# Altium project prototype_dual_channel.PrjPcb
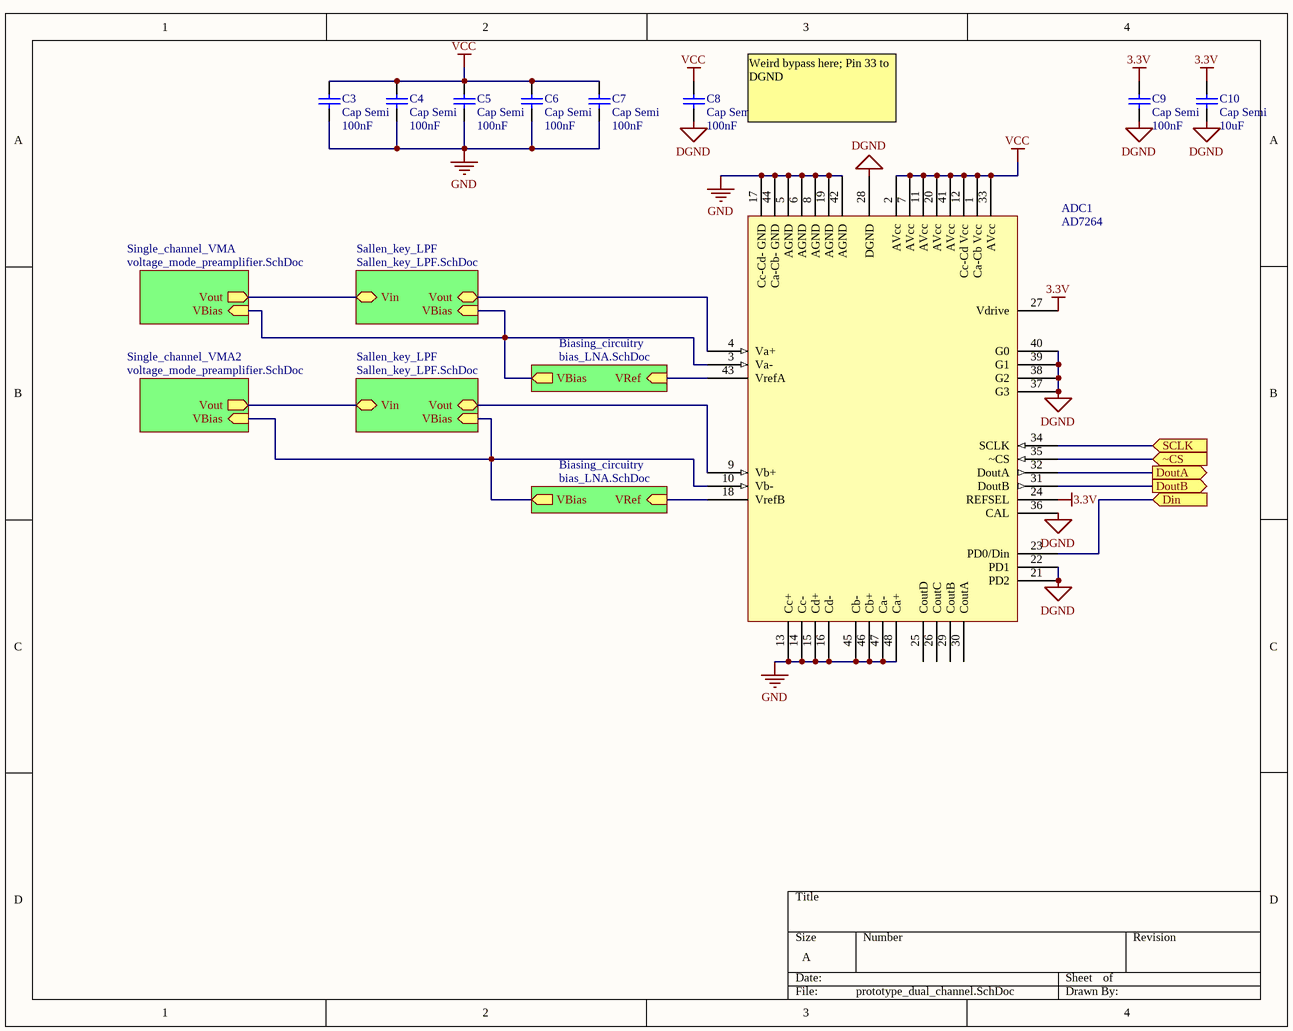
[diagram p0: prototype_dual_channel.SchDoc]
5 sheets, 53 parts. Net scope: hierarchical (ports join the sheet entries above them; power ports are global).
Sheets:
  prototype_dual_channel.SchDoc
    Single_channel_VMA = voltage_mode_preamplifier.SchDoc
    Single_channel_VMA2 = voltage_mode_preamplifier.SchDoc
    Sallen_key_LPF = Sallen_key_LPF.SchDoc
    Biasing_circuitry = bias_LNA.SchDoc
    Sallen_key_LPF = Sallen_key_LPF.SchDoc
    Biasing_circuitry = bias_LNA.SchDoc
  main_stack_dual_channel.SchDoc

## Sheet prototype_dual_channel.SchDoc
size A

### Parts
ADC1  AD7264  [TSQFP50P900X900-48N]
C3  Cap Semi  value 100nF  [C0805]
C4  Cap Semi  value 100nF  [C0805]
C5  Cap Semi  value 100nF  [C0805]
C6  Cap Semi  value 100nF  [C0805]
C7  Cap Semi  value 100nF  [C0805]
C8  Cap Semi  value 100nF  [C0805]
C9  Cap Semi  value 100nF  [C0805]
C10  Cap Semi  value 10uF  [C0805]

### Sub-sheets
Biasing_circuitry = bias_LNA.SchDoc: VRef (in), VBias (out)
Biasing_circuitry = bias_LNA.SchDoc: VRef (in), VBias (out)
Sallen_key_LPF = Sallen_key_LPF.SchDoc: VBias (in), Vin, Vout
Sallen_key_LPF = Sallen_key_LPF.SchDoc: VBias (in), Vin, Vout
Single_channel_VMA = voltage_mode_preamplifier.SchDoc: Vout (out), VBias (in)
Single_channel_VMA2 = voltage_mode_preamplifier.SchDoc: Vout (out), VBias (in)

### Ports
Din (in), DoutA (out), DoutB (out), SCLK (in), ~CS (in)

### Nets
3.3V: ADC1.24(REFSEL) ADC1.27(Vdrive) C9.2 C10.2
DGND: ADC1.21(PD2) ADC1.22(PD1) ADC1.28(DGND) ADC1.36(CAL) ADC1.37(G3) ADC1.38(G2) ADC1.39(G1) ADC1.40(G0) C8.1 C9.1 C10.1
GND: ADC1.5(AGND) ADC1.6(AGND) ADC1.8(AGND) ADC1.13(Cc+) ADC1.14(Cc-) ADC1.15(Cd+) ADC1.16(Cd-) ADC1.17(Cc-Cd-_GND) ADC1.19(AGND) ADC1.42(AGND) ADC1.44(Ca-Cb-_GND) ADC1.45(Cb-) ADC1.46(Cb+) ADC1.47(Ca-) ADC1.48(Ca+) C3.1 C4.1 C5.1 C6.1 C7.1
VCC: ADC1.1(Ca-Cb_Vcc) ADC1.2(AVcc) ADC1.7(AVcc) ADC1.11(AVcc) ADC1.12(Cc-Cd_Vcc) ADC1.20(AVcc) ADC1.33(AVcc) ADC1.41(AVcc) C3.2 C4.2 C5.2 C6.2 C7.2 C8.2
NetADC1_3: ADC1.3(Va-) ; sheet Single_channel_VMA/VBias, sheet Sallen_key_LPF/VBias, sheet Biasing_circuitry/VBias
NetADC1_4: ADC1.4(Va+) ; sheet Sallen_key_LPF/Vout
NetADC1_9: ADC1.9(Vb+) ; sheet Sallen_key_LPF/Vout
NetADC1_10: ADC1.10(Vb-) ; sheet Single_channel_VMA2/VBias, sheet Sallen_key_LPF/VBias, sheet Biasing_circuitry/VBias
NetADC1_18: ADC1.18(VrefB) ; sheet Biasing_circuitry/VRef
NetADC1_23: ADC1.23(PD0/Din) ; port Din
NetADC1_31: ADC1.31(DoutB) ; port DoutB
NetADC1_32: ADC1.32(DoutA) ; port DoutA
NetADC1_34: ADC1.34(SCLK) ; port SCLK
NetADC1_35: ADC1.35(~CS) ; port ~CS
NetADC1_43: ADC1.43(VrefA) ; sheet Biasing_circuitry/VRef
NetR1_Single_channel_VMA2_2: sheet Single_channel_VMA2/Vout, sheet Sallen_key_LPF/Vin
NetR1_Single_channel_VMA_2: sheet Single_channel_VMA/Vout, sheet Sallen_key_LPF/Vin

Not connected (* = marked no-connect by the designer): ADC1 25(CoutD) 26(CoutC) 29(CoutB) 30(CoutA)

### Notes on the sheet
- Weird bypass here; Pin 33 to DGND

### Library data of the parts
ADC1 = AD7264: AD7264 - 14 bit 1MSPS 2 channel ADC
C3-C10 = Cap Semi: Capacitor (Semiconductor SIM Model); Published: 8-Jun-2000; LatestRevisionDate: 29-May-2009; LatestRevisionNote: IPC-7351 Footprint Added.; PackageReference: C1206; Publisher: Altium Limited; PackageDescription: Chip Capacitor

## Sheet voltage_mode_preamplifier.SchDoc
size A
Used 2 times, as channels Single_channel_VMA, Single_channel_VMA2. Parts and nets are listed once, with the designators drawn on the sheet.
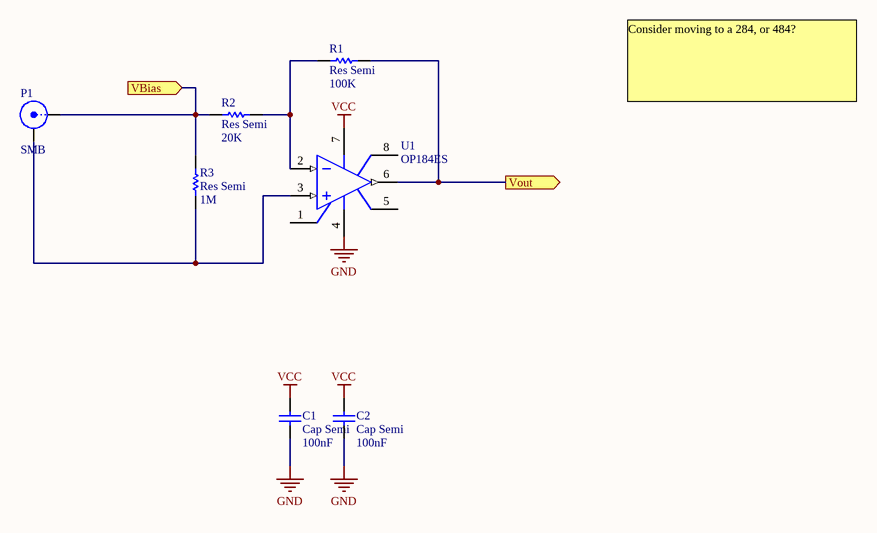
[diagram p1: voltage_mode_preamplifier.SchDoc]

### Parts
C1  Cap Semi  value 100nF  [C0805]
C2  Cap Semi  value 100nF  [C0805]
P1  SMB  [SMB_V-RJ45]
R1  Res Semi  value 100K  [RESC2012L]
R2  Res Semi  value 20K  [RESC2012L]
R3  Res Semi  value 1M  [RESC2012L]
U1  OP184ES  [SO-8_N]

### Ports
VBias (in), Vout (out)

### Nets
GND: C1.1 C2.1 U1.4(V-)
VCC: C1.2 C2.2 U1.7(V+)
VBias: P1.1(X) R2.1 R3.2 ; port VBias
Vout: R1.2 U1.6(OUT) ; port Vout
NetP1_2: P1.2(Y) R3.1 U1.3(IN+)
NetR1_1: R1.1 R2.2 U1.2(IN-)

Not connected (* = marked no-connect by the designer): U1 1(NUL) 5(NUL) 8(NC)

### Channels
Single_channel_VMA: designators end in _Single_channel_VMA; ports VBias=NetADC1_3 Vout=NetR1_Single_channel_VMA_2
Single_channel_VMA2: designators end in _Single_channel_VMA2; ports VBias=NetADC1_10 Vout=NetR1_Single_channel_VMA2_2

### Notes on the sheet
- Consider moving to a 284, or 484?

### Library data of the parts
C1 C2 = Cap Semi: Capacitor (Semiconductor SIM Model); Published: 8-Jun-2000; LatestRevisionDate: 29-May-2009; LatestRevisionNote: IPC-7351 Footprint Added.; PackageReference: C1206; Publisher: Altium Limited; PackageDescription: Chip Capacitor
P1 = SMB: SMB Straight Connector; LatestRevisionDate: 17-Jul-2002; LatestRevisionNote: Re-released for DXP Platform.; Publisher: Altium Limited
R1-R3 = Res Semi: Semiconductor Resistor; Published: 8-Jun-2000; LatestRevisionDate: 17-Jul-2002; LatestRevisionNote: Re-released for DXP Platform.; PackageReference: AXIAL-0.5; Publisher: Altium Limited
U1 = OP184ES: Precision Rail-to-Rail Input and Ouput Operational Amplifier; Note: Pin 8 is not connected.; Published: 8-Jun-2000; LatestRevisionDate: 13-Apr-2006; LatestRevisionNote: IPC-7351 Footprint Added.; DatasheetVersion: REV. 0 1996; PackageVersion: revA; PackageReference: SO-8; Publisher: Altium Limited; PackageDescription: 8-Pin Small Outline Integrated Circuit 1.27 mm Pitch; Code_JEDEC: MS-012-AA; Code_IPC: SOIC127P600-8; ComponentLink1Description: Manufacturer Link; ComponentLink1URL: http://www.analog.com/en/prod/0,,759_786_OP184%2C00.html; ComponentLink2Description: Datasheet; ComponentLink2URL: http://www.analog.com/UploadedFiles/Data_Sheets/390492658OP184_284_484_b.pdf; Digikey PN: OP184FSZ-REEL7CT-ND

## Sheet Sallen_key_LPF.SchDoc
size A
Used 2 times, as channels Sallen_key_LPF, Sallen_key_LPF. Parts and nets are listed once, with the designators drawn on the sheet.
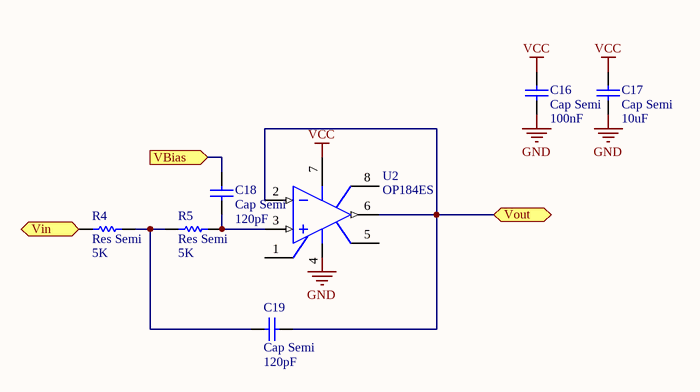
[diagram p2: Sallen_key_LPF.SchDoc]

### Parts
C16  Cap Semi  value 100nF  [C0805]
C17  Cap Semi  value 10uF  [C0805]
C18  Cap Semi  value 120pF  [C0805]
C19  Cap Semi  value 120pF  [C0805]
R4  Res Semi  value 5K  [RESC2012L]
R5  Res Semi  value 5K  [RESC2012L]
U2  OP184ES  [SO-8_N]

### Ports
VBias (in), Vin, Vout

### Nets
GND: C16.1 C17.1
VCC: C16.2 C17.2 U2.7(V+)
VBias: C18.2 ; port VBias
Vin: R4.1 ; port Vin
Vout: C19.1 U2.2(IN-) U2.6(OUT) ; port Vout
NetC18_1: C18.1 R5.2 U2.3(IN+)
NetC19_2: C19.2 R4.2 R5.1

Not connected (* = marked no-connect by the designer): U2 1(NUL) 4(V-) 5(NUL) 8(NC)

### Channels
Sallen_key_LPF: designators end in _Sallen_key_LPF#1; ports VBias=NetADC1_3 Vin=NetR1_Single_channel_VMA_2 Vout=NetADC1_4
Sallen_key_LPF: designators end in _Sallen_key_LPF#2; ports VBias=NetADC1_10 Vin=NetR1_Single_channel_VMA2_2 Vout=NetADC1_9

### Notes on the sheet
- Labels drawn without touching a wire or pin: GND

### Library data of the parts
C16-C19 = Cap Semi: Capacitor (Semiconductor SIM Model); Published: 8-Jun-2000; LatestRevisionDate: 29-May-2009; LatestRevisionNote: IPC-7351 Footprint Added.; PackageReference: C1206; Publisher: Altium Limited; PackageDescription: Chip Capacitor
R4 R5 = Res Semi: Semiconductor Resistor; Published: 8-Jun-2000; LatestRevisionDate: 17-Jul-2002; LatestRevisionNote: Re-released for DXP Platform.; PackageReference: AXIAL-0.5; Publisher: Altium Limited
U2 = OP184ES: as U1 on sheet voltage_mode_preamplifier; Published: 8-Jun-2000; LatestRevisionDate: 13-Apr-2006; LatestRevisionNote: IPC-7351 Footprint Added.; DatasheetVersion: REV. 0 1996; PackageVersion: revA; PackageReference: SO-8; Publisher: Altium Limited; PackageDescription: 8-Pin Small Outline Integrated Circuit 1.27 mm Pitch; Code_JEDEC: MS-012-AA; Code_IPC: SOIC127P600-8; ComponentLink1Description: Manufacturer Link; ComponentLink1URL: http://www.analog.com/en/prod/0,,759_786_OP184%2C00.html; ComponentLink2Description: Datasheet; ComponentLink2URL: http://www.analog.com/UploadedFiles/Data_Sheets/390492658OP184_284_484_b.pdf

## Sheet bias_LNA.SchDoc
size A
Used 2 times, as channels Biasing_circuitry, Biasing_circuitry. Parts and nets are listed once, with the designators drawn on the sheet.
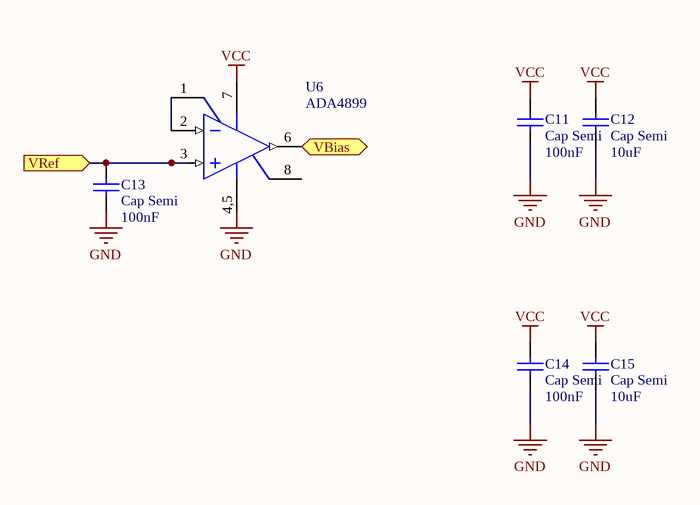
[diagram p3: bias_LNA.SchDoc]

### Parts
C11  Cap Semi  value 100nF  [C0805]
C12  Cap Semi  value 10uF  [C0805]
C13  Cap Semi  value 100nF  [C0805]
C14  Cap Semi  value 100nF  [C0805]
C15  Cap Semi  value 10uF  [C0805]
U6  ADA4899  [SO8_N]

### Ports
VBias (out), VRef (in)

### Nets
GND: C11.1 C12.1 C13.1 C14.1 C15.1 U6.4,5(V-)
VCC: C11.2 C12.2 C14.2 C15.2 U6.7(V+)
VBias: U6.6(OUT) ; port VBias
VRef: C13.2 U6.3(IN+) ; port VRef
NetU6_1: U6.1(FB) U6.2(IN-)

Not connected (* = marked no-connect by the designer): U6 8(CMPEN)

### Channels
Biasing_circuitry: designators end in _Biasing_circuitry#1; ports VBias=NetADC1_3 VRef=NetADC1_43
Biasing_circuitry: designators end in _Biasing_circuitry#2; ports VBias=NetADC1_10 VRef=NetADC1_18

### Library data of the parts
C11-C15 = Cap Semi: Capacitor (Semiconductor SIM Model); Published: 8-Jun-2000; LatestRevisionDate: 29-May-2009; LatestRevisionNote: IPC-7351 Footprint Added.; PackageReference: C1206; Publisher: Altium Limited; PackageDescription: Chip Capacitor
U6 = ADA4899: High Speed, Low Voltage Noise, Unity Gain Stable Op-Amp

## Sheet main_stack_dual_channel.SchDoc
size A
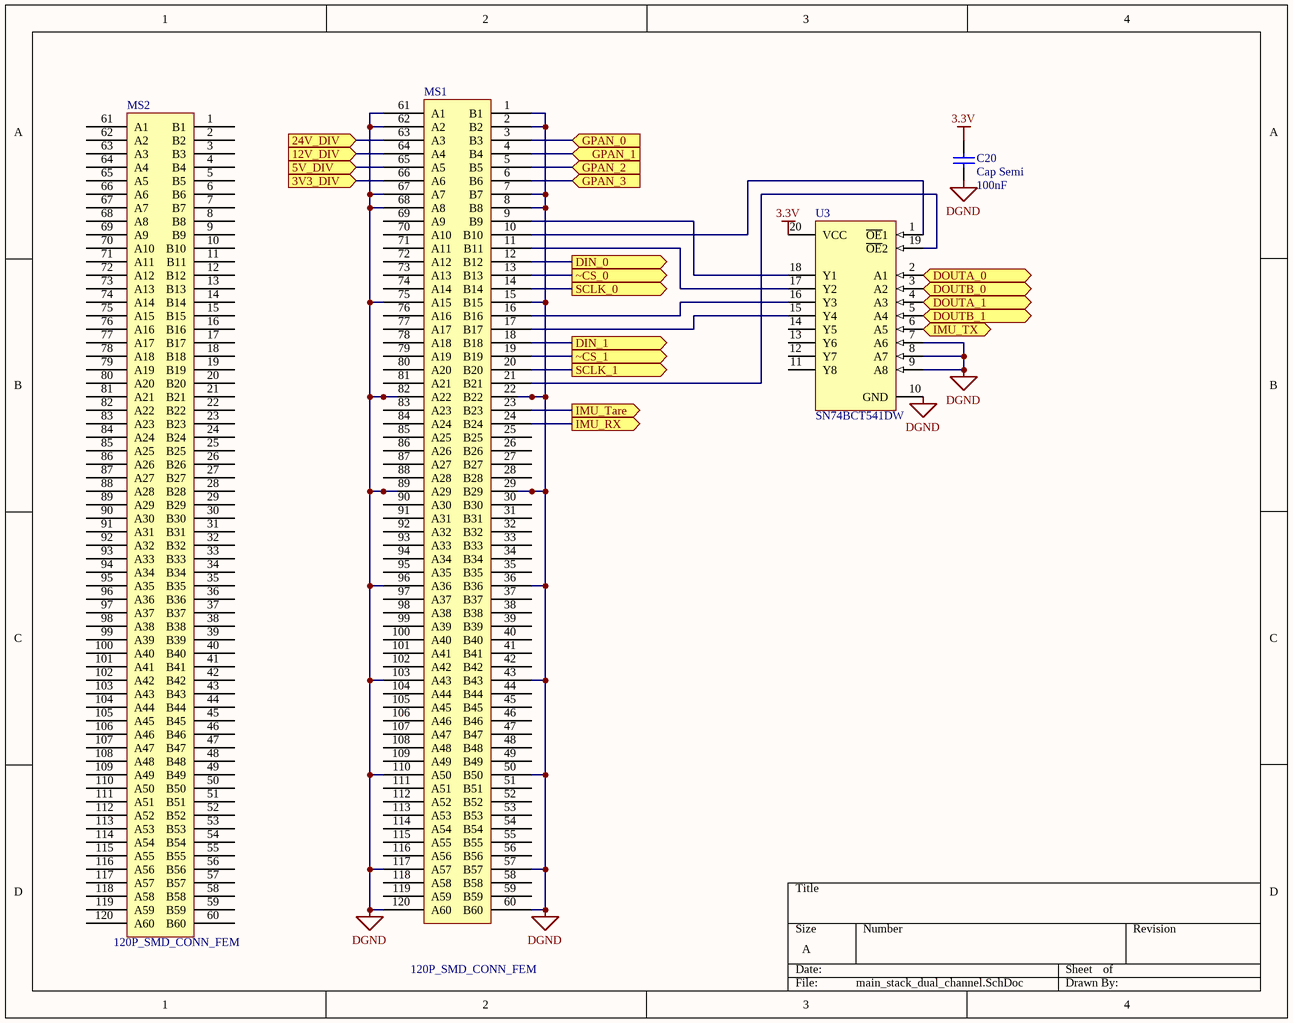
[diagram p4: main_stack_dual_channel.SchDoc]

### Parts
C20  Cap Semi  value 100nF  [C0805]
MS1  120P_SMD_CONN_FEM
MS2  120P_SMD_CONN_FEM
U3  SN74BCT541DW  [DW020_N]

### Ports
3V3_DIV (in), 5V_DIV (in), 12V_DIV (in), 24V_DIV (in), DIN_0 (out), DIN_1 (out), DOUTA_0 (in), DOUTA_1 (in), DOUTB_0 (in), DOUTB_1 (in), GPAN_0 (in), GPAN_1 (in), GPAN_2 (in), GPAN_3 (in), IMU_RX (out), IMU_Tare (out), IMU_TX (in), SCLK_0 (out), SCLK_1 (out), ~CS_0 (out), ~CS_1 (out)

### Nets
3.3V: C20.2 U3.20(VCC)
DGND: C20.1 MS1.1(B1) MS1.2(B2) MS1.7(B7) MS1.8(B8) MS1.15(B15) MS1.22(B22) MS1.29(B29) MS1.36(B36) MS1.43(B43) MS1.50(B50) MS1.57(B57) MS1.60(B60) MS1.61(A1) MS1.62(A2) MS1.67(A7) MS1.68(A8) MS1.75(A15) MS1.82(A22) MS1.89(A29) MS1.96(A36) MS1.103(A43) MS1.110(A50) MS1.117(A57) MS1.120(A60) U3.7(A6) U3.8(A7) U3.9(A8) U3.10(GND)
NetMS1_3: MS1.3(B3) ; port GPAN_0
NetMS1_4: MS1.4(B4) ; port GPAN_1
NetMS1_5: MS1.5(B5) ; port GPAN_2
NetMS1_6: MS1.6(B6) ; port GPAN_3
NetMS1_9: MS1.9(B9) U3.18(Y1)
NetMS1_10: MS1.10(B10) U3.1(~{OE}1)
NetMS1_11: MS1.11(B11) U3.17(Y2)
NetMS1_12: MS1.12(B12) ; port DIN_0
NetMS1_13: MS1.13(B13) ; port ~CS_0
NetMS1_14: MS1.14(B14) ; port SCLK_0
NetMS1_16: MS1.16(B16) U3.16(Y3)
NetMS1_17: MS1.17(B17) U3.15(Y4)
NetMS1_18: MS1.18(B18) ; port DIN_1
NetMS1_19: MS1.19(B19) ; port ~CS_1
NetMS1_20: MS1.20(B20) ; port SCLK_1
NetMS1_21: MS1.21(B21) U3.19(~{OE}2)
NetMS1_23: MS1.23(B23) ; port IMU_Tare
NetMS1_24: MS1.24(B24) ; port IMU_RX
NetMS1_63: MS1.63(A3) ; port 24V_DIV
NetMS1_64: MS1.64(A4) ; port 12V_DIV
NetMS1_65: MS1.65(A5) ; port 5V_DIV
NetMS1_66: MS1.66(A6) ; port 3V3_DIV
NetU3_2: U3.2(A1) ; port DOUTA_0
NetU3_3: U3.3(A2) ; port DOUTB_0
NetU3_4: U3.4(A3) ; port DOUTA_1
NetU3_5: U3.5(A4) ; port DOUTB_1
NetU3_6: U3.6(A5) ; port IMU_TX

Not connected (* = marked no-connect by the designer): MS1 25(B25) 26(B26) 27(B27) 28(B28) 30(B30) 31(B31) 32(B32) 33(B33) 34(B34) 35(B35) 37(B37) 38(B38) 39(B39) 40(B40) 41(B41) 42(B42) 44(B44) 45(B45) 46(B46) 47(B47) 48(B48) 49(B49) 51(B51) 52(B52) 53(B53) 54(B54) 55(B55) 56(B56) 58(B58) 59(B59) 69(A9) 70(A10) 71(A11) 72(A12) 73(A13) 74(A14) 76(A16) 77(A17) 78(A18) 79(A19) 80(A20) 81(A21) 83(A23) 84(A24) 85(A25) 86(A26) 87(A27) 88(A28) 90(A30) 91(A31) 92(A32) 93(A33) 94(A34) 95(A35) 97(A37) 98(A38) 99(A39) 100(A40) 101(A41) 102(A42) 104(A44) 105(A45) 106(A46) 107(A47) 108(A48) 109(A49) 111(A51) 112(A52) 113(A53) 114(A54) 115(A55) 116(A56) 118(A58) 119(A59); MS2 1(B1) 2(B2) 3(B3) 4(B4) 5(B5) 6(B6) 7(B7) 8(B8) 9(B9) 10(B10) 11(B11) 12(B12) 13(B13) 14(B14) 15(B15) 16(B16) 17(B17) 18(B18) 19(B19) 20(B20) 21(B21) 22(B22) 23(B23) 24(B24) 25(B25) 26(B26) 27(B27) 28(B28) 29(B29) 30(B30) 31(B31) 32(B32) 33(B33) 34(B34) 35(B35) 36(B36) 37(B37) 38(B38) 39(B39) 40(B40) 41(B41) 42(B42) 43(B43) 44(B44) 45(B45) 46(B46) 47(B47) 48(B48) 49(B49) 50(B50) 51(B51) 52(B52) 53(B53) 54(B54) 55(B55) 56(B56) 57(B57) 58(B58) 59(B59) 60(B60) 61(A1) 62(A2) 63(A3) 64(A4) 65(A5) 66(A6) 67(A7) 68(A8) 69(A9) 70(A10) 71(A11) 72(A12) 73(A13) 74(A14) 75(A15) 76(A16) 77(A17) 78(A18) 79(A19) 80(A20) 81(A21) 82(A22) 83(A23) 84(A24) 85(A25) 86(A26) 87(A27) 88(A28) 89(A29) 90(A30) 91(A31) 92(A32) 93(A33) 94(A34) 95(A35) 96(A36) 97(A37) 98(A38) 99(A39) 100(A40) 101(A41) 102(A42) 103(A43) 104(A44) 105(A45) 106(A46) 107(A47) 108(A48) 109(A49) 110(A50) 111(A51) 112(A52) 113(A53) 114(A54) 115(A55) 116(A56) 117(A57) 118(A58) 119(A59) 120(A60); U3 11(Y8) 12(Y7) 13(Y6) 14(Y5)

### Library data of the parts
C20 = Cap Semi: Capacitor (Semiconductor SIM Model); Published: 8-Jun-2000; LatestRevisionDate: 29-May-2009; LatestRevisionNote: IPC-7351 Footprint Added.; PackageReference: C1206; Publisher: Altium Limited; PackageDescription: Chip Capacitor
MS1 MS2 = 120P_SMD_CONN_FEM: Main Stack Connector, Female; Part Number: FX2-120P-1.27SV(71)
U3 = SN74BCT541DW: Octal Buffer/Driver with 3-State Outputs; ComponentAvailability: Obsolete; Published: 8-Jun-2000; LatestRevisionDate: 13-Apr-2006; LatestRevisionNote: IPC-7351 Footprint Added.; DatasheetVersion: Apr-1994; PackageVersion: Mar-2000; PackageReference: DW020; Publisher: Altium Limited; PackageDescription: 20-Pin Plastic Small Outline Integrated Circuit 1.27 mm Pitch; Code_JEDEC: MS-013; Code_IPC: SOIC127P1030-20; ComponentLink1Description: Manufacturer Link; ComponentLink1URL: http://www.ti.com/; ComponentLink2Description: Discontinuation Notice; ComponentLink2URL: http://focus.ti.com/docs/prod/folders/print/sn74bct541.html

## Nets that join several sheets
3.3V: prototype_dual_channel (ADC1.24 ADC1.27 C9.2 C10.2), main_stack_dual_channel (C20.2 U3.20)
DGND: prototype_dual_channel (11 pins), main_stack_dual_channel (29 pins)
GND: prototype_dual_channel (20 pins), Single_channel_VMA (C1_Single_channel_VMA.1 C2_Single_channel_VMA.1 U1_Single_channel_VMA.4), Single_channel_VMA2 (C1_Single_channel_VMA2.1 C2_Single_channel_VMA2.1 U1_Single_channel_VMA2.4), Sallen_key_LPF (C16_Sallen_key_LPF#1.1 C17_Sallen_key_LPF#1.1), Biasing_circuitry (6 pins), Sallen_key_LPF (C16_Sallen_key_LPF#2.1 C17_Sallen_key_LPF#2.1), Biasing_circuitry (6 pins)
VCC: prototype_dual_channel (14 pins), Single_channel_VMA (C1_Single_channel_VMA.2 C2_Single_channel_VMA.2 U1_Single_channel_VMA.7), Single_channel_VMA2 (C1_Single_channel_VMA2.2 C2_Single_channel_VMA2.2 U1_Single_channel_VMA2.7), Sallen_key_LPF (C16_Sallen_key_LPF#1.2 C17_Sallen_key_LPF#1.2 U2_Sallen_key_LPF#1.7), Biasing_circuitry (5 pins), Sallen_key_LPF (C16_Sallen_key_LPF#2.2 C17_Sallen_key_LPF#2.2 U2_Sallen_key_LPF#2.7), Biasing_circuitry (5 pins)
NetADC1_3: prototype_dual_channel (ADC1.3), Single_channel_VMA (P1_Single_channel_VMA.1 R2_Single_channel_VMA.1 R3_Single_channel_VMA.2), Sallen_key_LPF (C18_Sallen_key_LPF#1.2), Biasing_circuitry (U6_Biasing_circuitry#1.6)
NetADC1_4: prototype_dual_channel (ADC1.4), Sallen_key_LPF (C19_Sallen_key_LPF#1.1 U2_Sallen_key_LPF#1.2 U2_Sallen_key_LPF#1.6)
NetADC1_9: prototype_dual_channel (ADC1.9), Sallen_key_LPF (C19_Sallen_key_LPF#2.1 U2_Sallen_key_LPF#2.2 U2_Sallen_key_LPF#2.6)
NetADC1_10: prototype_dual_channel (ADC1.10), Single_channel_VMA2 (P1_Single_channel_VMA2.1 R2_Single_channel_VMA2.1 R3_Single_channel_VMA2.2), Sallen_key_LPF (C18_Sallen_key_LPF#2.2), Biasing_circuitry (U6_Biasing_circuitry#2.6)
NetADC1_18: prototype_dual_channel (ADC1.18), Biasing_circuitry (C13_Biasing_circuitry#2.2 U6_Biasing_circuitry#2.3)
NetADC1_43: prototype_dual_channel (ADC1.43), Biasing_circuitry (C13_Biasing_circuitry#1.2 U6_Biasing_circuitry#1.3)
NetR1_Single_channel_VMA2_2: Single_channel_VMA2 (R1_Single_channel_VMA2.2 U1_Single_channel_VMA2.6), Sallen_key_LPF (R4_Sallen_key_LPF#2.1)
NetR1_Single_channel_VMA_2: Single_channel_VMA (R1_Single_channel_VMA.2 U1_Single_channel_VMA.6), Sallen_key_LPF (R4_Sallen_key_LPF#1.1)